# Altium project MB1605.PrjPcb (part 2 of 7)

## Sheet MP257_14x14.SchDoc: STM32MP257  I/Os
size A3; Date: Not used; ApprovedBy: Not used; CheckedBy: Not used; Author: Not used; CompanyName: STMicroelectronics; DrawnBy: Not used; Engineer: Not used; Organization: Not used; Address1: Not used; Address2: Not used; Address3: Not used; Address4: Not used; DocumentNumber: Not used; Revision: Not used; SheetNumber: 3; SheetTotal: 18; CurrentTime: Not used; CurrentDate: Not used; Time: Not used; DocumentFullPathAndName: Not used; DocumentName: Not used; ModifiedDate: Not used; ImagePath: Not used; ProjectName: Not used; Application_BuildNumber: Not used
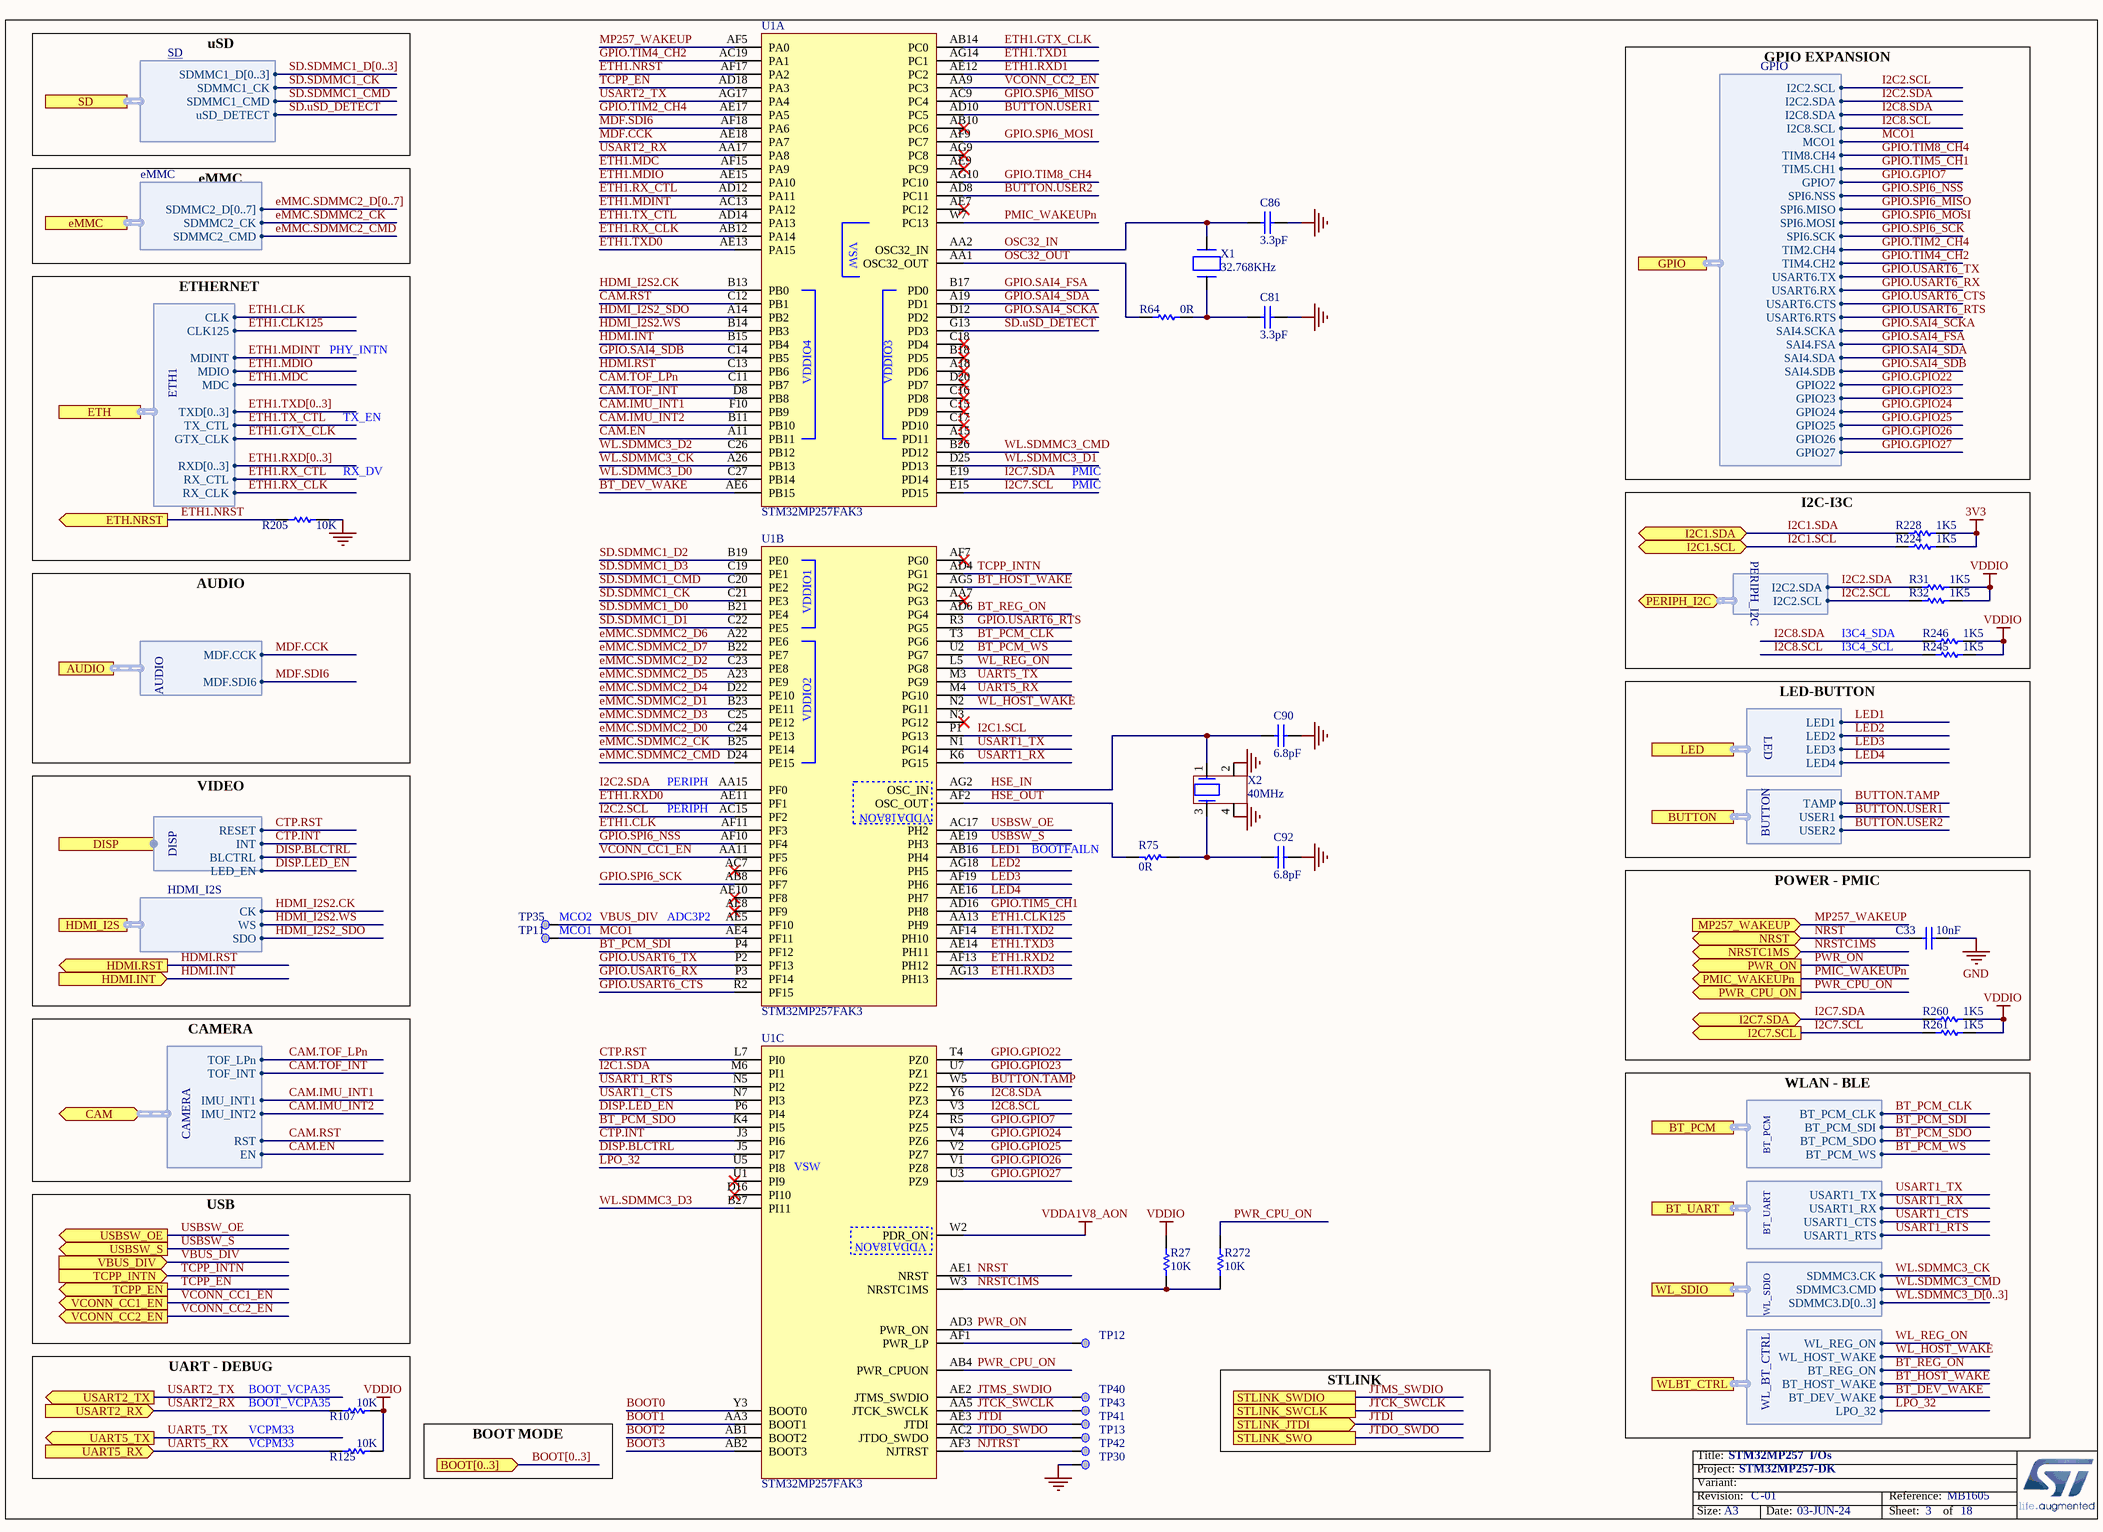
[diagram p4: MP257_14x14.SchDoc]

### Parts
C33  value 10nF  [C0402]  (hidden comment: Capacitor)
C81  value 3.3pF  [C0402]  (hidden comment: Capacitor)
C86  value 3.3pF  [C0402]  (hidden comment: Capacitor)
C90  value 6.8pF  [C0402]  (hidden comment: Capacitor)
C92  value 6.8pF  [C0402]  (hidden comment: Capacitor)
R27  value 10K  [R0402]  (hidden comment: Resistor)
R31  value 1K5  [R0402]  (hidden comment: Resistor)
R32  value 1K5  [R0402]  (hidden comment: Resistor)
R64  value 0R  [R0402]
R75  value 0R  [R0402]
R107  value 10K  [R0402]  (hidden comment: Resistor)
R125  value 10K  [R0402]  (hidden comment: Resistor)
R205  value 10K  [R0402]  (hidden comment: Resistor)
R224  value 1K5  [R0402]  (hidden comment: Resistor)
R228  value 1K5  [R0402]  (hidden comment: Resistor)
R245  value 1K5  [R0402]  (hidden comment: Resistor)
R246  value 1K5  [R0402]  (hidden comment: Resistor)
R260  value 1K5  [R0402]  (hidden comment: Resistor)
R261  value 1K5  [R0402]  (hidden comment: Resistor)
R272  value 10K  [R0402]  (hidden comment: Resistor)
TP11  Test Point  [TP_SMD_1MM]  (value not drawn)  (no BOM)
TP12  Test Point  [TP_SMD_1MM]  (value not drawn)  (no BOM)
TP13  Test Point  [TP_SMD_1MM]  (value not drawn)  (no BOM)
TP30  Test Point  [TP_SMD_1MM]  (value not drawn)  (no BOM)
TP35  Test Point  [TP_SMD_1MM]  (value not drawn)  (no BOM)
TP40  Test Point  [TP_SMD_1MM]  (value not drawn)  (no BOM)
TP41  Test Point  [TP_SMD_1MM]  (value not drawn)  (no BOM)
TP42  Test Point  [TP_SMD_1MM]  (value not drawn)  (no BOM)
TP43  Test Point  [TP_SMD_1MM]  (value not drawn)  (no BOM)
U1  STM32MP257FAK3  [ICC_TFBGA424_14X14_P050_H1P20_CODE-B0A2]  (parts A,B,C of 9)
X1  value 32.768KHz  [CRY_NX2012SA_2P]  (hidden comment: XTAL_2_PINS)
X2  value 40MHz  [CRY_NX1612SA_4P]  (hidden comment: XTAL_4_PINS)

### Ports
AUDIO (harness AUDIO), BOOT[0..3] (in), BT_PCM (harness BT_PCM), BT_UART (harness BT_UART), BUTTON (harness BUTTON), CAM (bidir, harness CAMERA), DISP (harness DISP), eMMC (harness eMMC), ETH (harness ETH1), ETH.NRST (out), GPIO (harness GPIO), HDMI.INT (in), HDMI.RST (out), HDMI_I2S (harness HDMI_I2S), I2C1.SCL (bidir), I2C1.SDA (bidir), I2C7.SCL (out), I2C7.SDA (bidir), LED (harness LED), MP257_WAKEUP (in), NRST (bidir), NRSTC1MS (bidir), PERIPH_I2C (bidir, harness PERIPH_I2C), PMIC_WAKEUPn (out), PWR_CPU_ON (out), PWR_ON (out), SD (harness SD), STLINK_JTDI (in), STLINK_SWCLK, STLINK_SWDIO, STLINK_SWO, TCPP_EN (out), TCPP_INTN (in), UART5_RX (in), UART5_TX (out), USART2_RX (in), USART2_TX (out), USBSW_OE (out), USBSW_S (out), VBUS_DIV (in), VCONN_CC1_EN (out), VCONN_CC2_EN (out), WL_SDIO (harness WL_SDIO), WLBT_CTRL (harness WL_BT_CTRL)

### Harnesses
ETH1: MDINT, CLK125, TXD[0..3], MDIO, MDC, RX_CLK, GTX_CLK, TX_CTL, RXD[0..3], RX_CTL, CLK
HDMI_I2S: CK, SDO, WS
GPIO: I2C2.SCL, I2C2.SDA, I2C8.SDA, MCO1, TIM8.CH4, TIM5.CH1, GPIO7, SPI6.NSS, SPI6.MISO, SPI6.MOSI, SPI6.SCK, TIM2.CH4, TIM4.CH2, USART6.TX, USART6.RX, USART6.CTS, USART6.RTS, I2C8.SCL, SAI4.SCKA, SAI4.FSA, SAI4.SDA, SAI4.SDB, GPIO22, GPIO23, GPIO24, GPIO25, GPIO26, GPIO27
PERIPH_I2C: I2C2.SDA, I2C2.SCL
LED: LED1, LED2, LED3, LED4
BUTTON: TAMP, USER1, USER2
CAMERA: TOF_LPn, TOF_INT, IMU_INT1, IMU_INT2, RST, EN
DISP: RESET, INT, BLCTRL, LED_EN
SD: SDMMC1_D[0..3], SDMMC1_CK, SDMMC1_CMD, uSD_DETECT
BT_PCM: BT_PCM_CLK, BT_PCM_SDI, BT_PCM_SDO, BT_PCM_WS
BT_UART: USART1_TX, USART1_RX, USART1_CTS, USART1_RTS
WL_SDIO: SDMMC3.CMD, SDMMC3.CK, SDMMC3.D[0..3]
WL_BT_CTRL: WL_REG_ON, WL_HOST_WAKE, BT_REG_ON, BT_HOST_WAKE, BT_DEV_WAKE, LPO_32
eMMC: SDMMC2_CK, SDMMC2_CMD, SDMMC2_D[0..7]
AUDIO: MDF.CCK, MDF.SDI6

### Nets
3V3: R224.2 R228.2
GND: C33.1 C81.2 C86.2 C90.1 C92.2 R205.2 TP30.1 X2.2 X2.4
VDDA1V8_AON: U1.W2(PDR_ON)
VDDIO: R27.2 R31.2 R32.2 R107.2 R125.2 R245.2 R246.2 R260.2 R261.2
BOOT0: U1.Y3(BOOT0)
BOOT1: U1.AA3(BOOT1)
BOOT2: U1.AB1(BOOT2)
BOOT3: U1.AB2(BOOT3)
BT_DEV_WAKE: U1.AE6(PB15) ; port WLBT_CTRL.BT_DEV_WAKE
BT_HOST_WAKE: U1.AG5(PG2) ; port WLBT_CTRL.BT_HOST_WAKE
BT_PCM_CLK: U1.T3(PG6) ; port BT_PCM.BT_PCM_CLK
BT_PCM_SDI: U1.P4(PF12) ; port BT_PCM.BT_PCM_SDI
BT_PCM_SDO: U1.K4(PI5) ; port BT_PCM.BT_PCM_SDO
BT_PCM_WS: U1.U2(PG7) ; port BT_PCM.BT_PCM_WS
BT_REG_ON: U1.AD6(PG4) ; port WLBT_CTRL.BT_REG_ON
BUTTON.TAMP: U1.W5(PZ2) ; port BUTTON.TAMP
BUTTON.USER1: U1.AD10(PC5) ; port BUTTON.USER1
BUTTON.USER2: U1.AD8(PC11) ; port BUTTON.USER2
CAM.EN: U1.A11(PB11) ; port CAM.EN
CAM.IMU_INT1: U1.F10(PB9) ; port CAM.IMU_INT1
CAM.IMU_INT2: U1.B11(PB10) ; port CAM.IMU_INT2
CAM.RST: U1.C12(PB1) ; port CAM.RST
CAM.TOF_INT: U1.D8(PB8) ; port CAM.TOF_INT
CAM.TOF_LPn: U1.C11(PB7) ; port CAM.TOF_LPn
CTP.INT: U1.J3(PI6) ; port DISP.INT
CTP.RST: U1.L7(PI0) ; port DISP.RESET
DISP.BLCTRL: U1.J5(PI7) ; port DISP.BLCTRL
DISP.LED_EN: U1.P6(PI4) ; port DISP.LED_EN
eMMC.SDMMC2_CK: U1.B25(PE14) ; port eMMC.SDMMC2_CK
eMMC.SDMMC2_CMD: U1.D24(PE15) ; port eMMC.SDMMC2_CMD
eMMC.SDMMC2_D0: U1.C24(PE13)
eMMC.SDMMC2_D1: U1.B23(PE11)
eMMC.SDMMC2_D2: U1.C23(PE8)
eMMC.SDMMC2_D3: U1.C25(PE12)
eMMC.SDMMC2_D4: U1.D22(PE10)
eMMC.SDMMC2_D5: U1.A23(PE9)
eMMC.SDMMC2_D6: U1.A22(PE6)
eMMC.SDMMC2_D7: U1.B22(PE7)
ETH1.CLK: U1.AF11(PF3) ; port ETH.CLK
ETH1.CLK125: U1.AA13(PH9) ; port ETH.CLK125
ETH1.GTX_CLK: U1.AB14(PC0) ; port ETH.GTX_CLK
ETH1.MDC: U1.AF15(PA9) ; port ETH.MDC
ETH1.MDINT: U1.AC13(PA12) ; port ETH.MDINT
ETH1.MDIO: U1.AE15(PA10) ; port ETH.MDIO
ETH1.NRST: R205.1 U1.AF17(PA2) ; port ETH.NRST
ETH1.RX_CLK: U1.AB12(PA14) ; port ETH.RX_CLK
ETH1.RX_CTL: U1.AD12(PA11) ; port ETH.RX_CTL
ETH1.RXD0: U1.AE11(PF1)
ETH1.RXD1: U1.AE12(PC2)
ETH1.RXD2: U1.AF13(PH12)
ETH1.RXD3: U1.AG13(PH13)
ETH1.TX_CTL: U1.AD14(PA13) ; port ETH.TX_CTL
ETH1.TXD0: U1.AE13(PA15)
ETH1.TXD1: U1.AG14(PC1)
ETH1.TXD2: U1.AF14(PH10)
ETH1.TXD3: U1.AE14(PH11)
GPIO.GPIO7: U1.R5(PZ5) ; port GPIO.GPIO7  [project net EXP_GPIO7]
GPIO.GPIO22: U1.T4(PZ0) ; port GPIO.GPIO22  [project net EXP_GPIO22]
GPIO.GPIO23: U1.U7(PZ1) ; port GPIO.GPIO23  [project net EXP_GPIO23]
GPIO.GPIO24: U1.V4(PZ6) ; port GPIO.GPIO24  [project net EXP_GPIO24]
GPIO.GPIO25: U1.V2(PZ7) ; port GPIO.GPIO25  [project net EXP_GPIO25]
GPIO.GPIO26: U1.V1(PZ8) ; port GPIO.GPIO26  [project net EXP_GPIO26]
GPIO.GPIO27: U1.U3(PZ9) ; port GPIO.GPIO27  [project net EXP_GPIO27]
GPIO.SAI4_FSA: U1.B17(PD0) ; port GPIO.SAI4.FSA  [project net EXP_GPIO19]
GPIO.SAI4_SCKA: U1.D12(PD2) ; port GPIO.SAI4.SCKA  [project net EXP_GPIO18]
GPIO.SAI4_SDA: U1.A19(PD1) ; port GPIO.SAI4.SDA  [project net EXP_GPIO20]
GPIO.SAI4_SDB: U1.C14(PB5) ; port GPIO.SAI4.SDB  [project net EXP_GPIO21]
GPIO.SPI6_MISO: U1.AC9(PC4) ; port GPIO.SPI6.MISO  [project net EXP_GPIO9]
GPIO.SPI6_MOSI: U1.AF9(PC7) ; port GPIO.SPI6.MOSI  [project net EXP_GPIO10]
GPIO.SPI6_NSS: U1.AF10(PF4) ; port GPIO.SPI6.NSS  [project net EXP_GPIO8]
GPIO.SPI6_SCK: U1.AB8(PF7) ; port GPIO.SPI6.SCK  [project net EXP_GPIO11]
GPIO.TIM2_CH4: U1.AE17(PA5) ; port GPIO.TIM2.CH4  [project net EXP_GPIO12]
GPIO.TIM4_CH2: U1.AC19(PA1) ; port GPIO.TIM4.CH2  [project net EXP_GPIO13]
GPIO.TIM5_CH1: U1.AD16(PH8) ; port GPIO.TIM5.CH1  [project net EXP_GPIO6]
GPIO.TIM8_CH4: U1.AG10(PC10) ; port GPIO.TIM8.CH4  [project net EXP_GPIO5]
GPIO.USART6_CTS: U1.R2(PF15) ; port GPIO.USART6.CTS  [project net EXP_GPIO16]
GPIO.USART6_RTS: U1.R3(PG5) ; port GPIO.USART6.RTS  [project net EXP_GPIO17]
GPIO.USART6_RX: U1.P3(PF14) ; port GPIO.USART6.RX  [project net EXP_GPIO15]
GPIO.USART6_TX: U1.P2(PF13) ; port GPIO.USART6.TX  [project net EXP_GPIO14]
HDMI.INT: U1.B15(PB4) ; port HDMI.INT
HDMI.RST: U1.C13(PB6) ; port HDMI.RST
HDMI_I2S2.CK: U1.B13(PB0) ; port HDMI_I2S.CK
HDMI_I2S2.WS: U1.B14(PB3) ; port HDMI_I2S.WS
HDMI_I2S2_SDO: U1.A14(PB2) ; port HDMI_I2S.SDO
HSE_IN: C90.2 U1.AG2(OSC_IN) X2.1
HSE_OUT: R75.2 U1.AF2(OSC_OUT)
I2C1.SCL: R224.1 U1.P1(PG13) ; port I2C1.SCL
I2C1.SDA: R228.1 U1.M6(PI1) ; port I2C1.SDA
I2C2.SCL: R32.1 U1.AC15(PF2) ; port GPIO.I2C2.SCL, port PERIPH_I2C.I2C2.SCL
I2C2.SDA: R31.1 U1.AA15(PF0) ; port GPIO.I2C2.SDA, port PERIPH_I2C.I2C2.SDA
I2C7.SCL: R261.1 U1.E15(PD15) ; port I2C7.SCL
I2C7.SDA: R260.1 U1.E19(PD14) ; port I2C7.SDA
I2C8.SCL: R245.1 U1.V3(PZ4) ; port GPIO.I2C8.SCL  [project net EXP_GPIO3]
I2C8.SDA: R246.1 U1.Y6(PZ3) ; port GPIO.I2C8.SDA  [project net EXP_GPIO2]
JTCK_SWCLK: TP43.1 U1.AA5(JTCK_SWCLK) ; port STLINK_SWCLK
JTDI: TP41.1 U1.AE3(JTDI) ; port STLINK_JTDI
JTDO_SWDO: TP13.1 U1.AC2(JTDO_SWDO) ; port STLINK_SWO
JTMS_SWDIO: TP40.1 U1.AE2(JTMS_SWDIO) ; port STLINK_SWDIO
LED1: U1.AB16(PH4) ; port LED.LED1
LED2: U1.AG18(PH5) ; port LED.LED2
LED3: U1.AF19(PH6) ; port LED.LED3
LED4: U1.AE16(PH7) ; port LED.LED4
LPO_32: U1.U5(PI8) ; port WLBT_CTRL.LPO_32
MCO1: TP11.1 U1.AE4(PF11) ; port GPIO.MCO1  [project net EXP_GPIO4]
MDF.CCK: U1.AE18(PA7) ; port AUDIO.MDF.CCK
MDF.SDI6: U1.AF18(PA6) ; port AUDIO.MDF.SDI6
MP257_WAKEUP: U1.AF5(PA0) ; port MP257_WAKEUP
NJTRST: TP42.1 U1.AF3(NJTRST)
NRST: C33.2 U1.AE1(NRST) ; port NRST
NRSTC1MS: R27.1 R272.1 U1.W3(NRSTC1MS) ; port NRSTC1MS
OSC32_IN: C86.1 U1.AA2(OSC32_IN) X1.2(X2)
OSC32_OUT: R64.1 U1.AA1(OSC32_OUT)
PMIC_WAKEUPn: U1.W7(PC13) ; port PMIC_WAKEUPn
PWR_CPU_ON: R272.2 U1.AB4(PWR_CPUON) ; port PWR_CPU_ON
PWR_ON: U1.AD3(PWR_ON) ; port PWR_ON
SD.SDMMC1_CK: U1.C21(PE3) ; port SD.SDMMC1_CK
SD.SDMMC1_CMD: U1.C20(PE2) ; port SD.SDMMC1_CMD
SD.SDMMC1_D0: U1.B21(PE4)
SD.SDMMC1_D1: U1.C22(PE5)
SD.SDMMC1_D2: U1.B19(PE0)
SD.SDMMC1_D3: U1.C19(PE1)
SD.uSD_DETECT: U1.G13(PD3) ; port SD.uSD_DETECT
TCPP_EN: U1.AD18(PA3) ; port TCPP_EN
TCPP_INTN: U1.AD4(PG1) ; port TCPP_INTN
UART5_RX: R125.1 U1.M4(PG10) ; port UART5_RX
UART5_TX: U1.M3(PG9) ; port UART5_TX
USART1_CTS: U1.N7(PI3) ; port BT_UART.USART1_CTS
USART1_RTS: U1.N5(PI2) ; port BT_UART.USART1_RTS
USART1_RX: U1.K6(PG15) ; port BT_UART.USART1_RX
USART1_TX: U1.N1(PG14) ; port BT_UART.USART1_TX
USART2_RX: R107.1 U1.AA17(PA8) ; port USART2_RX
USART2_TX: U1.AG17(PA4) ; port USART2_TX
USBSW_OE: U1.AC17(PH2) ; port USBSW_OE
USBSW_S: U1.AE19(PH3) ; port USBSW_S
VBUS_DIV: TP35.1 U1.AE5(PF10) ; port VBUS_DIV
VCONN_CC1_EN: U1.AA11(PF5) ; port VCONN_CC1_EN
VCONN_CC2_EN: U1.AA9(PC3) ; port VCONN_CC2_EN
WL.SDMMC3_CK: U1.A26(PB13) ; port WL_SDIO.SDMMC3.CK
WL.SDMMC3_CMD: U1.B26(PD12) ; port WL_SDIO.SDMMC3.CMD
WL.SDMMC3_D0: U1.C27(PB14)
WL.SDMMC3_D1: U1.D25(PD13)
WL.SDMMC3_D2: U1.C26(PB12)
WL.SDMMC3_D3: U1.B27(PI11)
WL_HOST_WAKE: U1.N2(PG11) ; port WLBT_CTRL.WL_HOST_WAKE
WL_REG_ON: U1.L5(PG8) ; port WLBT_CTRL.WL_REG_ON
NetC81_1: C81.1 R64.2 X1.1(X1)
NetC92_1: C92.1 R75.1 X2.3
NetTP12_1: TP12.1 U1.AF1(PWR_LP)

Not connected (* = marked no-connect by the designer): U1 A15(PD11)* A18(PD6)* AA7(PG3)* AB10(PC6)* AC7(PF6)* AE7(PC12)* AE8(PF9)* AE9(PC9)* AE10(PF8)* AF7(PG0)* AG9(PC8)* B18(PD5)* C15(PD9)* C16(PD8)* C17(PD10)* C18(PD4)* D16(PI10)* D20(PD7)* N3(PG12)* U1(PI9)*

### Buses and harness runs
bus BOOT[0..3] = port BOOT[0..3]
bus eMMC.SDMMC2_D[0..7]
bus ETH1.RXD[0..3]
bus ETH1.TXD[0..3]
bus SD.SDMMC1_D[0..3]
bus WL.SDMMC3_D[0..3]

### Notes on the sheet
- uSD
- eMMC
- PHY_INTN
- TX_EN
- (near R205) RX_DV
- PMIC
- GPIO EXPANSION
- (near R205) ETHERNET
- I2C-I3C
- I3C4_SDA
- I3C4_SCL
- AUDIO
- PERIPH
- (near R75) BOOTFAILN
- LED-BUTTON
- MCO2
- MCO1
- ADC3P2
- VIDEO
- POWER - PMIC
- CAMERA
- USB
- (near R107) BOOT_VCPA35
- UART - DEBUG
- VCPM33
- BOOT MODE
- STLINK
- WLAN - BLE
- Title:
- Project:
- Size:
- Revision:
- Variant:
- A3
- -
- Date:
- Reference:
- Sheet:
- of
- (in symbol MCD-03375, part A) VSW
- (in symbol MCD-03375, part C) VSW

### Library data of the parts
C33 = MCD-00011: Capacitor, MLCC, 10nF, 16V, X7R, 10%, 0402, T=0.5mm; Manufacturer_Part_Number: CC0402KRX7R7BB103; Manufacturer: YAGEO; Provided_By: SUBCO; Initial_Board_Reference: MB1274; Internal_Part_Number: MCD-00011; Status: Released; Part_Type: Capacitor; Package: C0402; ComponentLink1Description: Datasheet; ComponentLink1URL: http://tunmcdsvn.tun.st.com/Component_Datasheet_Library/Trunk/Capacitors/Yageo_Multilayer_Capacitor_X7R_series_100pF_to_22uF; ECCN_US: n/a; ECCN_EU: n/a
C81 C86 = MCD-01775: Capacitor, MLCC, 3.3pF, 50V, NPO, +/-0.1pF, 0402, T=0.5mm; Part_Preference: Recommended; Manufacturer: YAGEO; Manufacturer_Part_Number: CC0402BRNPO9BN3R3; Component_Country_Of_Origin: China; ShowFields: YES; ID: 3875; Internal_Part_Number: MCD-01775; Status: Released; Part_Type: Capacitor; Package: 0402; ComponentLink1URL: http://tunmcdsvn.tun.st.com/Component_Documentation_Library/Trunk/Capacitor/YAGEO_NP0_Series; Order_Code_Digikey: 311-1621-1-ND; Order_Code_Farnell: N/A; Order_Code_RS: N/A
C90 C92 = MCD-00674: Capacitor, MLCC, 6.8pF, 50V, NPO, +-0.25pF, 0402, T=0.5mm; Manufacturer_Part_Number: CC0402CRNPO9BN6R8; Manufacturer: YAGEO; Part_Preference: Recommended; Provided_By: SUBCO; Initial_Board_Reference: MB1319; Component_Country_Of_Origin: China; ID: 3068; ShowFields: YES; Internal_Part_Number: MCD-00674; Status: Released; Part_Type: Capacitor; Package: 0402; ComponentLink1Description: Datasheet; ComponentLink1URL: http://tunmcdsvn.tun.st.com/Component_Documentation_Library/Trunk/Capacitor/YAGEO_NP0_Series; ECCN_US: n/a; ECCN_EU: n/a; Alternate_Manufacturer: N/A; Alternate_Manufacturer_Part_Number: N/A; Order_Code_Digikey: 311-3327-1-ND; Order_Code_Farnell: N/A; Order_Code_RS: N/A
R27 R107 R125 R272 = MCD-00053: Resistor,10K,0402,1%,1/16W; BMS_Part_Number: 9131590; Part_Preference: Recommended; Manufacturer: YAGEO; Manufacturer_Part_Number: RC0402FR-0710KL; Component_Country_Of_Origin: China; ID: 2539; ShowFields: YES; Internal_Part_Number: MCD-00053; Status: Released; Part_Type: Resistor; Package: 0402; ComponentLink1Description: Datasheet; ComponentLink1URL: http://tunmcdsvn.tun.st.com/Component_Documentation_Library/Trunk/Resistor/YAGEO_RC_L_Series; Order_Code_Digikey: 311-10.0KLRCT-ND; Order_Code_Farnell: 9239359; Order_Code_RS: N/A; Alternate_Manufacturer: N/A; Alternate_Manufacturer_Part_Number: N/A
R31 R32 R224 R228 R245 R246 R260 R261 = MCD-00068: Resistor,1K5,0402,1%,1/16W; Part_Preference: Recommended; Manufacturer: YAGEO; Manufacturer_Part_Number: RC0402FR-071K5L; Component_Country_Of_Origin: China; ID: 2524; ShowFields: YES; Internal_Part_Number: MCD-00068; Status: Released; Part_Type: Resistor; Package: 0402; ComponentLink1Description: Datasheet; ComponentLink1URL: http://tunmcdsvn.tun.st.com/Component_Documentation_Library/Trunk/Resistor/YAGEO_RC_L_Series; Order_Code_Digikey: 311-1.50KLRCT-ND; Order_Code_Farnell: 9239251; Order_Code_RS: N/A
  R31 R32 R224 R228 R245 R246: Alternate_Manufacturer: N/A; Alternate_Manufacturer_Part_Number: N/A
R64 R75 = MCD-00052: Resistor,0R,0402,5%,1/16W; Manufacturer_Part_Number: RC0402JR-070RL; Manufacturer: YAGEO; Part_Preference: Recommended; Provided_By: SUBCO; Initial_Board_Reference: mb1274; Order_Code_RS: 618-5804; Component_Country_Of_Origin: China; ID: 2540; ShowFields: YES; Internal_Part_Number: MCD-00052; ComponentLink1Description: Datasheet; ECCN_US: n/a; ECCN_EU: n/a; Status: Released; Part_Type: Resistor; ComponentLink1URL: http://tunmcdsvn.tun.st.com/Component_Documentation_Library/Trunk/Resistor/YAGEO_RC_L_Series; Package: 0402; Alternate_Manufacturer: N/A; Alternate_Manufacturer_Part_Number: N/A; Order_Code_Digikey: 311-0.0JRCT-ND; Order_Code_Farnell: 9232516RL
R205 = MCD-00053: Resistor,10K,0402,1%,1/16W; Manufacturer_Part_Number: RC0402FR-0710KL; Manufacturer: YAGEO; BMS_Part_Number: 9131590; Part_Preference: Recommended; Component_Country_Of_Origin: China; ID: 2539; ShowFields: YES; Internal_Part_Number: MCD-00053; ComponentLink1Description: Datasheet; Status: Released; Part_Type: Resistor; ComponentLink1URL: http://tunmcdsvn.tun.st.com/Component_Documentation_Library/Trunk/Resistor/YAGEO_RC_L_Series; Package: 0402; Order_Code_Digikey: 311-10.0KLRCT-ND; Order_Code_Farnell: 9239359; Order_Code_RS: N/A; Alternate_Manufacturer: N/A; Alternate_Manufacturer_Part_Number: N/A
TP11-TP13 TP30 TP35 TP40-TP43 = MCD-00074: Test Point 1mm; Part_Type: Misc; Part_Preference: Recommended; Initial_Board_Reference: MB1274; ID: 2518; ShowFields: YES; Internal_Part_Number: MCD-00074; Status: Released; Manufacturer_Part_Number: n/a; Manufacturer: n/a; ComponentLink1Description: Datasheet; ComponentLink1URL: http://na; ECCN_US: n/a; ECCN_EU: n/a; Provided_By: n/a; Order_Code_Digikey: N/A; Order_Code_Farnell: N/A; Order_Code_RS: N/A
U1 = MCD-03375: MPU , 2xCortex-A35@1.5GHz, Cortex-M33@400MHz, TFBGA 14x14, pitch 0.5, 648KB SRAM, With Crypto; Part_Type: IC; Part_Preference: Recommended; Manufacturer: STMICROELECTRONICS; Component_Country_Of_Origin: Unknown; ShowFields: YES; ID: 5491; Value: STM32MP257FAK3; Internal_Part_Number: MCD-03375; Status: Checked; Manufacturer_Part_Number: STM32MP257FAK3; Package: TFBGA; ComponentLink1URL: http://tunmcdsvn.tun.st.com/Component_Documentation_Library/Trunk/IC/STMICROELECTRONICS_STM32MP257FAK3; Order_Code_Digikey: N/A; Order_Code_Farnell: N/A; Order_Code_RS: N/A
X1 = MCD-01479: Crystal, 32.768kHz, 6pF, +/-20ppm, 80K, 2.05x1.2mm; BMS_Part_Number: 9157049; Part_Type: Crystal_Osc; Part_Preference: Recommended; Manufacturer: NDK; Manufacturer_Part_Number: NX2012SA-32.768KHZ-EXS00A-MU00527; Component_Country_Of_Origin: Unknown; ShowFields: YES; ID: 3579; Internal_Part_Number: MCD-01479; Status: Released; Package: 2.05x1.2mm; ComponentLink1URL: http://tunmcdsvn.tun.st.com/Component_Documentation_Library/Trunk/Crytal_Oscillator/NDK_NX2012SA_Series; Order_Code_Digikey: 644-1352; Order_Code_Farnell: N/A; Order_Code_RS: N/A
X2 = MCD-02344: Crystal, 40MHz, 6pF, +/-20ppm, 80R, 1.6x1.2mm; Part_Type: Crystal_Osc; Part_Preference: Recommended; Manufacturer: NDK; Manufacturer_Part_Number: NX1612SA-40MHZ-EXS00A-CS13836; Component_Country_Of_Origin: Unknown; ShowFields: YES; ID: 4450; Internal_Part_Number: MCD-02344; Status: Checked; Package: 1.6x1.2mm; ComponentLink1URL: http://tunmcdsvn.tun.st.com/Component_Documentation_Library/Trunk/Crytal_Oscillator/NDK_NX1612SA_Series/; Order_Code_Digikey: N/A; Order_Code_Farnell: N/A; Order_Code_RS: N/A

## Sheet Power_PMIC.SchDoc: Power PMIC
size A3; Date: Not used; ApprovedBy: Not used; CheckedBy: Not used; Author: Not used; CompanyName: STMicroelectronics; DrawnBy: Not used; Engineer: Not used; Organization: Not used; Address1: Not used; Address2: Not used; Address3: Not used; Address4: Not used; DocumentNumber: Not used; Revision: Not used; SheetNumber: 4; SheetTotal: 18; CurrentTime: Not used; CurrentDate: Not used; Time: Not used; DocumentFullPathAndName: Not used; DocumentName: Not used; ModifiedDate: Not used; ImagePath: Not used; ProjectName: Not used; Application_BuildNumber: Not used
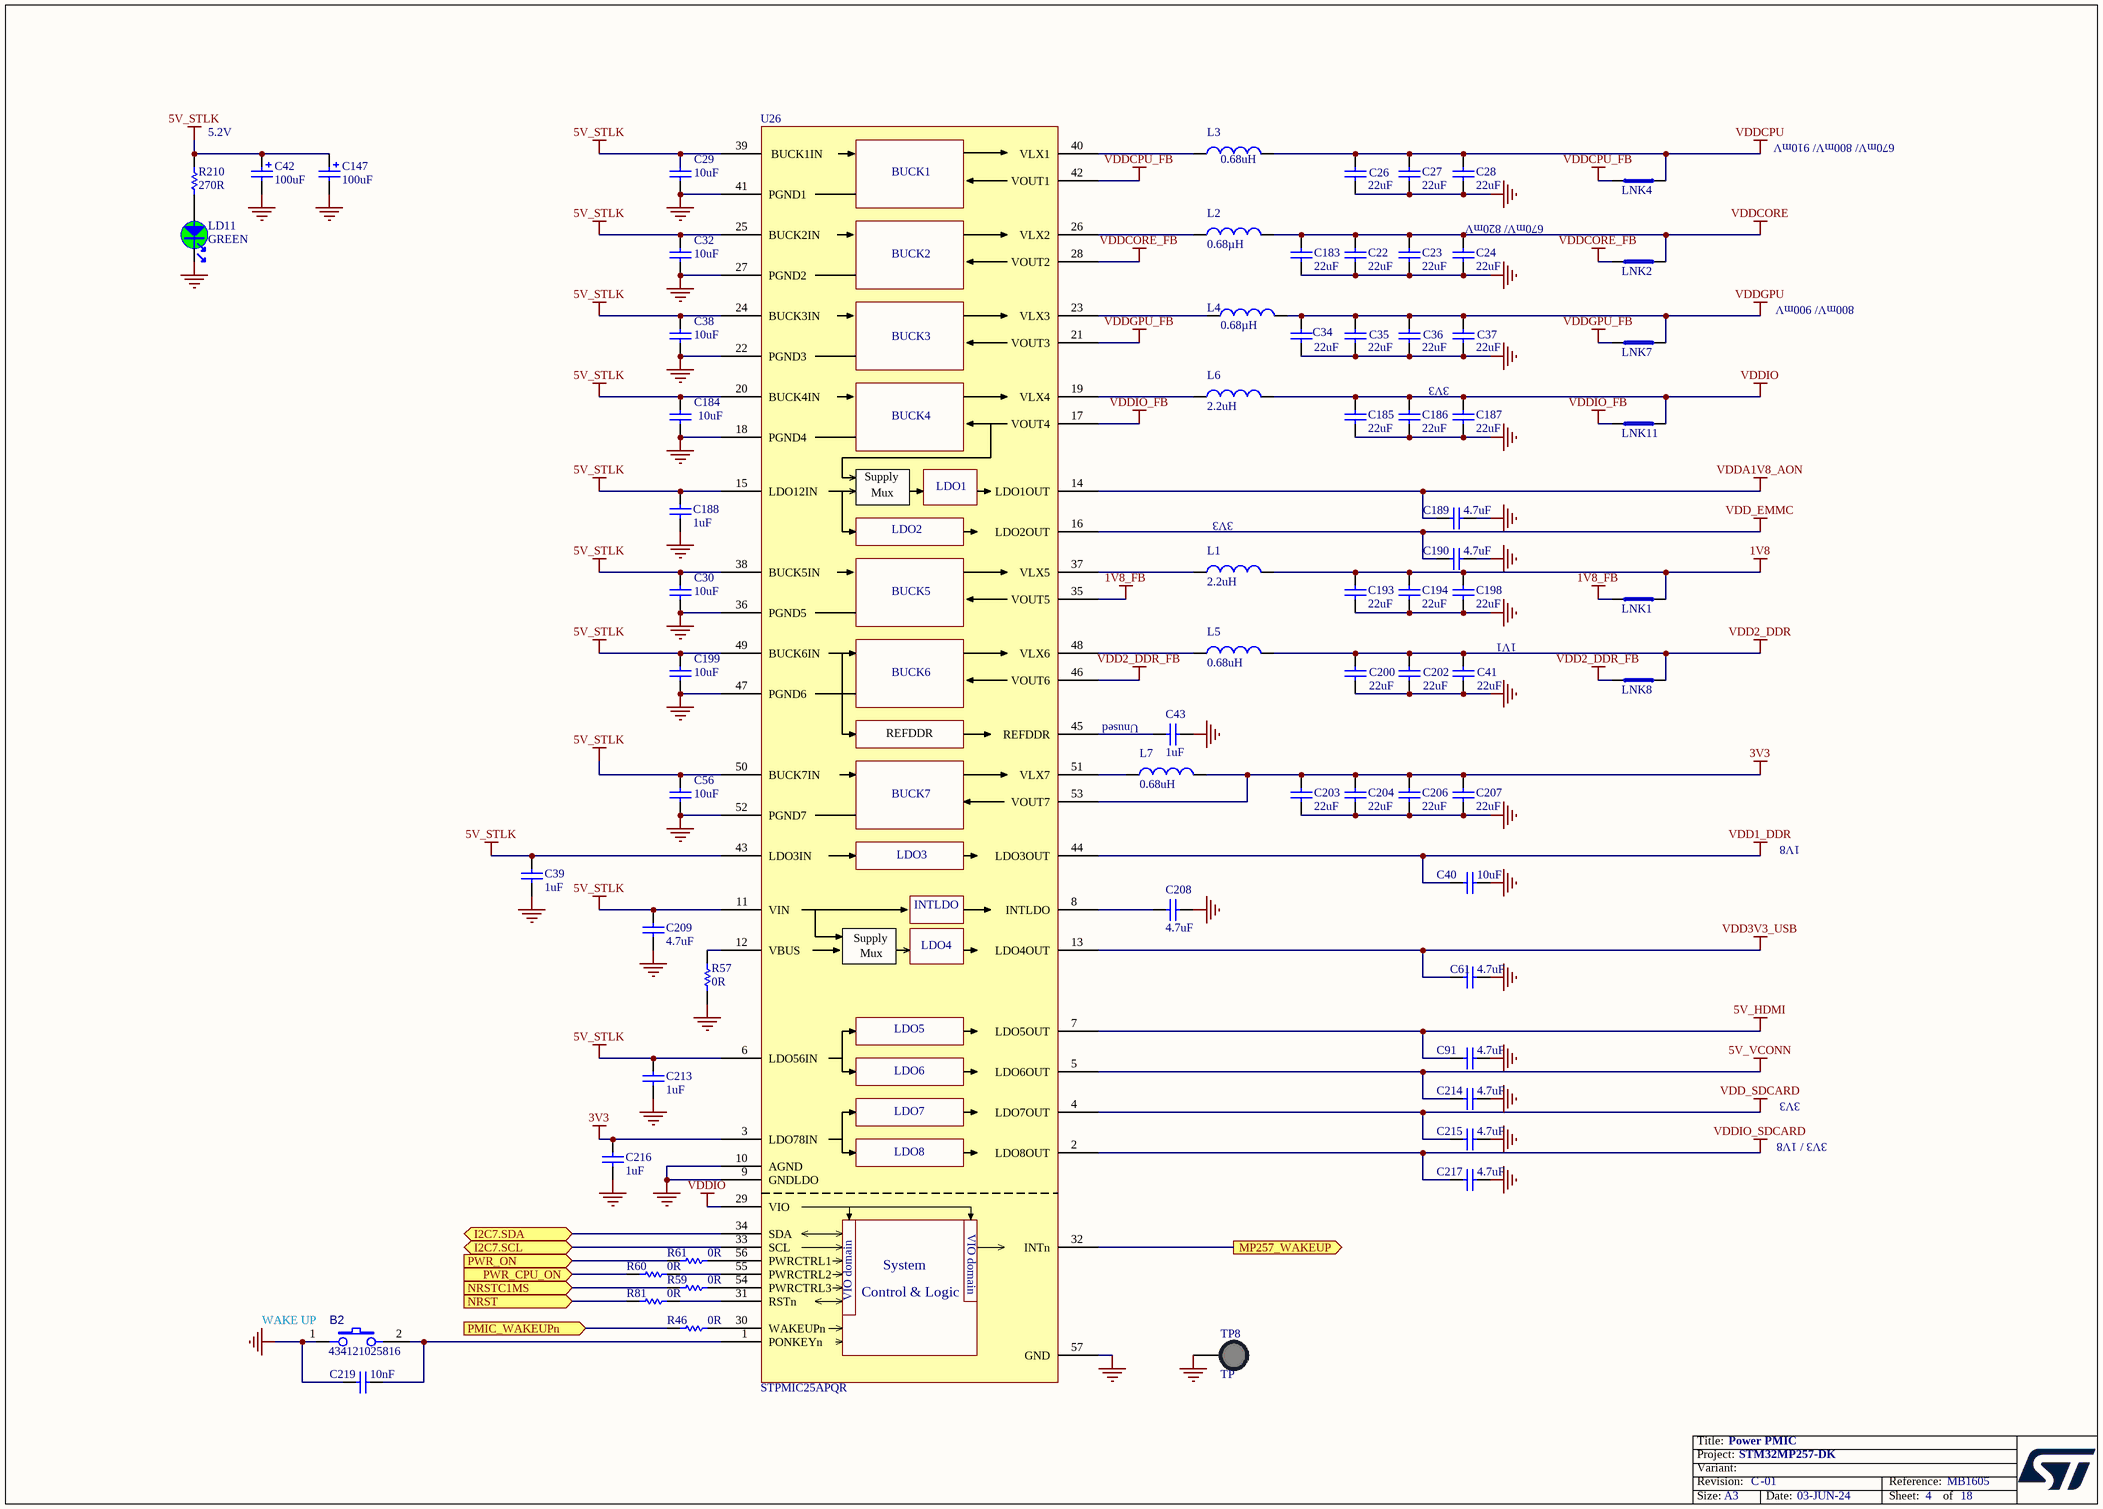
[diagram p5: Power_PMIC.SchDoc]

### Parts
B2  value 434121025816  [SWI_WE_434121025816]  (hidden comment: SW_PUSH_SMD_2P)
C22  value 22uF  [C0603]  (hidden comment: Capacitor)
C23  value 22uF  [C0603]  (hidden comment: Capacitor)
C24  value 22uF  [C0603]  (hidden comment: Capacitor)
C26  value 22uF  [C0603]  (hidden comment: Capacitor)
C27  value 22uF  [C0603]  (hidden comment: Capacitor)
C28  value 22uF  [C0603]  (hidden comment: Capacitor)
C29  value 10uF  [C0603]  (hidden comment: Capacitor)
C30  value 10uF  [C0603]  (hidden comment: Capacitor)
C32  value 10uF  [C0603]  (hidden comment: Capacitor)
C34  value 22uF  [C0603]  (hidden comment: Capacitor)
C35  value 22uF  [C0603]  (hidden comment: Capacitor)
C36  value 22uF  [C0603]  (hidden comment: Capacitor)
C37  value 22uF  [C0603]  (hidden comment: Capacitor)
C38  value 10uF  [C0603]  (hidden comment: Capacitor)
C39  value 1uF  [C0402]  (hidden comment: Capacitor)
C40  value 10uF  [C0402]  (hidden comment: Capacitor)
C41  value 22uF  [C0603]  (hidden comment: Capacitor)
C42  value 100uF  [CPOL_TCJ-B_1210_H210]  (hidden comment: Cap_POL_TANA)
C43  value 1uF  [C0402]  (hidden comment: Capacitor)
C56  value 10uF  [C0603]  (hidden comment: Capacitor)
C61  value 4.7uF  [C0402]  (hidden comment: Capacitor)
C91  value 4.7uF  [C0402]  (hidden comment: Capacitor)
C147  value 100uF  [CPOL_TCJ-B_1210_H210]  (hidden comment: Cap_POL_TANA)
C183  value 22uF  [C0603]  (hidden comment: Capacitor)
C184  value 10uF  [C0603]  (hidden comment: Capacitor)
C185  value 22uF  [C0805]  (hidden comment: Capacitor)
C186  value 22uF  [C0805]  (hidden comment: Capacitor)
C187  value 22uF  [C0805]  (hidden comment: Capacitor)
C188  value 1uF  [C0402]  (hidden comment: Capacitor)
C189  value 4.7uF  [C0402]  (hidden comment: Capacitor)
C190  value 4.7uF  [C0402]  (hidden comment: Capacitor)
C193  value 22uF  [C0805]  (hidden comment: Capacitor)
C194  value 22uF  [C0805]  (hidden comment: Capacitor)
C198  value 22uF  [C0805]  (hidden comment: Capacitor)
C199  value 10uF  [C0603]  (hidden comment: Capacitor)
C200  value 22uF  [C0603]  (hidden comment: Capacitor)
C202  value 22uF  [C0603]  (hidden comment: Capacitor)
C203  value 22uF  [C0805]  (hidden comment: Capacitor)
C204  value 22uF  [C0805]  (hidden comment: Capacitor)
C206  value 22uF  [C0805]  (hidden comment: Capacitor)
C207  value 22uF  [C0805]  (hidden comment: Capacitor)
C208  value 4.7uF  [C0402]  (hidden comment: Capacitor)
C209  value 4.7uF  [C0402]  (hidden comment: Capacitor)
C213  value 1uF  [C0402]  (hidden comment: Capacitor)
C214  value 4.7uF  [C0402]  (hidden comment: Capacitor)
C215  value 4.7uF  [C0402]  (hidden comment: Capacitor)
C216  value 1uF  [C0402]  (hidden comment: Capacitor)
C217  value 4.7uF  [C0402]  (hidden comment: Capacitor)
C219  value 10nF  [C0402]  (hidden comment: Capacitor)
L1  value 2.2uH  [IND_2016_MURATA_LQM2MPN2R2NG0]  (hidden comment: Inductor)
L2  value 0.68µH  [IND_2520_TOKO_DFE252012P]  (hidden comment: Inductor)
L3  value 0.68uH  [IND_2016_MURATA_LQM2MPN2R2NG0]  (hidden comment: Inductor)
L4  value 0.68µH  [IND_2520_TOKO_DFE252012P]  (hidden comment: Inductor)
L5  value 0.68uH  [IND_2016_MURATA_LQM2MPN2R2NG0]  (hidden comment: Inductor)
L6  value 2.2uH  [IND_2016_MURATA_LQM2MPN2R2NG0]  (hidden comment: Inductor)
L7  value 0.68uH  [IND_2016_MURATA_LQM2MPN2R2NG0]  (hidden comment: Inductor)
LD11  value GREEN  [LED_0603_OSRAM_LG-Q396-PS-35_GREEN_1A2K_H0P4]  (hidden comment: LED_green)
LNK1  link_200  [LINK200]  (value not drawn)  (no BOM)
LNK2  link_200  [LINK200]  (value not drawn)  (no BOM)
LNK4  link_200  [LINK200]  (value not drawn)  (no BOM)
LNK7  link_200  [LINK200]  (value not drawn)  (no BOM)
LNK8  link_200  [LINK200]  (value not drawn)  (no BOM)
LNK11  link_200  [LINK200]  (value not drawn)  (no BOM)
R46  value 0R  [R0402]
R57  value 0R  [R0402]
R59  value 0R  [R0402]
R60  value 0R  [R0402]
R61  value 0R  [R0402]
R81  value 0R  [R0402]
R210  value 270R  [R0402]  (hidden comment: Resistor)
TP8  value TP  [TP_PTH-1P02MM_TEST-TERMINAL_RS_101-2391_BLACK]  (hidden comment: Test_pin_conn_black)
U26  STPMIC25APQR  [ICC_QFN56-EPAD_6P5X6P5_P040]

### Ports
I2C7.SCL (bidir), I2C7.SDA (bidir), MP257_WAKEUP (out), NRST (in), NRSTC1MS (in), PMIC_WAKEUPn (in), PWR_CPU_ON (in), PWR_ON (in)

### Nets
1V8: C193.2 C194.2 C198.2 L1.2 LNK1.2
1V8_FB: LNK1.1 U26.35(VOUT5)
3V3: C203.2 C204.2 C206.2 C207.2 C216.2 L7.2 U26.3(LDO78IN) U26.53(VOUT7)
5V_HDMI: C91.1 U26.7(LDO5OUT)
5V_STLK: C29.2 C30.2 C32.2 C38.2 C39.2 C42.1 C56.2 C147.1 C184.2 C188.2 C199.2 C209.2 C213.2 R210.1 U26.6(LDO56IN) U26.11(VIN) U26.15(LDO12IN) U26.20(BUCK4IN) U26.24(BUCK3IN) U26.25(BUCK2IN) U26.38(BUCK5IN) U26.39(BUCK1IN) U26.43(LDO3IN) U26.49(BUCK6IN) U26.50(BUCK7IN)
5V_VCONN: C214.1 U26.5(LDO6OUT)
GND: B2.1 C22.1 C23.1 C24.1 C26.1 C27.1 C28.1 C29.1 C30.1 C32.1 C34.1 C35.1 C36.1 C37.1 C38.1 C39.1 C40.1 C41.1 C42.2 C43.1 C56.1 C61.1 C91.2 C147.2 C183.1 C184.1 C185.1 C186.1 C187.1 C188.1 C189.1 C190.2 C193.1 C194.1 C198.1 C199.1 C200.1 C202.1 C203.1 C204.1 C206.1 C207.1 C208.2 C209.1 C213.1 C214.2 C215.2 C216.1 C217.2 C219.1 LD11.2 R57.1 TP8.1 U26.9(GNDLDO) U26.10(AGND) U26.18(PGND4) U26.22(PGND3) U26.27(PGND2) U26.36(PGND5) U26.41(PGND1) U26.47(PGND6) U26.52(PGND7) U26.57(GND)
VDD1_DDR: C40.2 U26.44(LDO3OUT)
VDD2_DDR: C41.2 C200.2 C202.2 L5.2 LNK8.2
VDD2_DDR_FB: LNK8.1 U26.46(VOUT6)
VDD3V3_USB: C61.2 U26.13(LDO4OUT)
VDD_EMMC: C190.1 U26.16(LDO2OUT)
VDD_SDCARD: C215.1 U26.4(LDO7OUT)
VDDA1V8_AON: C189.2 U26.14(LDO1OUT)
VDDCORE: C22.2 C23.2 C24.2 C183.2 L2.2 LNK2.2
VDDCORE_FB: LNK2.1 U26.28(VOUT2)
VDDCPU: C26.2 C27.2 C28.2 L3.2 LNK4.1
VDDCPU_FB: LNK4.2 U26.42(VOUT1)
VDDGPU: C34.2 C35.2 C36.2 C37.2 L4.2 LNK7.2
VDDGPU_FB: LNK7.1 U26.21(VOUT3)
VDDIO: C185.2 C186.2 C187.2 L6.2 LNK11.2 U26.29(VIO)
VDDIO_FB: LNK11.1 U26.17(VOUT4)
VDDIO_SDCARD: C217.1 U26.2(LDO8OUT)
I2C7.SCL: U26.33(SCL) ; port I2C7.SCL
I2C7.SDA: U26.34(SDA) ; port I2C7.SDA
MP257_WAKEUP: U26.32(INTn) ; port MP257_WAKEUP
NRST: R81.1 ; port NRST
NRSTC1MS: R59.1 ; port NRSTC1MS
PMIC_WAKEUPn: R46.1 ; port PMIC_WAKEUPn
PWR_CPU_ON: R60.1 ; port PWR_CPU_ON
PWR_ON: R61.1 ; port PWR_ON
NetB2_2: B2.2 C219.2 U26.1(PONKEYn)
NetC43_2: C43.2 U26.45(REFDDR)
NetC208_1: C208.1 U26.8(INTLDO)
NetL1_1: L1.1 U26.37(VLX5)
NetL2_1: L2.1 U26.26(VLX2)
NetL3_1: L3.1 U26.40(VLX1)
NetL4_1: L4.1 U26.23(VLX3)
NetL5_1: L5.1 U26.48(VLX6)
NetL6_1: L6.1 U26.19(VLX4)
NetL7_1: L7.1 U26.51(VLX7)
NetLD11_1: LD11.1 R210.2
NetR46_2: R46.2 U26.30(WAKEUPn)
NetR57_2: R57.2 U26.12(VBUS)
NetR59_2: R59.2 U26.54(PWRCTRL3)
NetR60_2: R60.2 U26.55(PWRCTRL2)
NetR61_2: R61.2 U26.56(PWRCTRL1)
NetR81_2: R81.2 U26.31(RSTn)

### Notes on the sheet
- 5.2V
- 670mV/ 800mV/ 910mV
- (near C24) 670mV/ 820mV
- 800mV/ 900mV
- 3V3
- (near L1) 3V3
- 1V1
- Unused
- 1V8
- 3V3 / 1V8
- (near B2) WAKE UP
- Title:
- Project:
- Size:
- Revision:
- Variant:
- A3
- -
- Date:
- Reference:
- Sheet:
- of
- (in symbol MCD-03000) BUCK1; BUCK2; BUCK3; BUCK4; Supply; LDO1; Mux; LDO2; BUCK5; BUCK6; BUCK7; LDO3; LDO4; LDO5; LDO6; LDO7; LDO8; VIO domain; System; Control & Logic

### Library data of the parts
B2 = MCD-03492: Switch tactile, SPST-NO, 50mA, 12V, 6x3.8mm; Part_Type: Misc; Part_Preference: Recommended; Manufacturer: WURTH ELEKTRONIC; Component_Country_Of_Origin: China°; ShowFields: YES; ID: 5608; Internal_Part_Number: MCD-03492; Status: Checked; Manufacturer_Part_Number: 434121025816; Package: 6x3.8mm; ComponentLink1URL: http://tunmcdsvn.tun.st.com/Component_Documentation_Library/Trunk/Misc/WURTH_ELECTRONIK_434121025816; Order_Code_Digikey: 732-7045-2-ND; Order_Code_Farnell: 1867991; Order_Code_RS: N/A
C22-C24 C26 C34-C37 C41 C200 C202 = MCD-00100: Capacitor, MLCC, 22uF, 6V3, X5R, +/-20%, 0603, T=0,8mm; Manufacturer_Part_Number: GRM188R60J226MEA0J; Manufacturer: MURATA; Part_Preference: Recommended; Component_Country_Of_Origin: Japan; ID: 2766; ShowFields: YES; Internal_Part_Number: MCD-00100; Status: Released; Part_Type: Capacitor; Package: 0603; ComponentLink1Description: Part_Information; ComponentLink1URL: http://tunmcdsvn.tun.st.com/Component_Documentation_Library/Trunk/Capacitor/MURATA_GRM_Series; Order_Code_Digikey: 490-7612-2-ND; Order_Code_Farnell: N/A; Order_Code_RS: N/A; Alternate_Manufacturer: N/A; Alternate_Manufacturer_Part_Number: N/A
C27 C28 C183 = MCD-00100: Capacitor, MLCC, 22uF, 6V3, X5R, +/-20%, 0603, T=0,8mm; Part_Preference: Recommended; Manufacturer: MURATA; Manufacturer_Part_Number: GRM188R60J226MEA0J; Component_Country_Of_Origin: Japan; ID: 2766; ShowFields: YES; Internal_Part_Number: MCD-00100; Status: Released; Part_Type: Capacitor; Package: 0603; ComponentLink1URL: http://tunmcdsvn.tun.st.com/Component_Documentation_Library/Trunk/Capacitor/MURATA_GRM_Series; Order_Code_Digikey: 490-7612-2-ND; Order_Code_Farnell: N/A; Order_Code_RS: N/A; ComponentLink1Description: Part_Information; Alternate_Manufacturer: N/A; Alternate_Manufacturer_Part_Number: N/A
C29 C30 C32 C38 C56 C184 C199 = MCD-00099: Capacitor, MLCC, 10uF, 10V, X5R, +/-10%, 0603, T=0,8mm; Manufacturer_Part_Number: GRM188R61A106KE69D; Manufacturer: MURATA; Part_Preference: Recommended; Order_Code_RS: 170-6168; Component_Country_Of_Origin: Japan; ID: 2770; ShowFields: YES; Internal_Part_Number: MCD-00099; Status: Released; Part_Type: Capacitor; Package: 0603; ComponentLink1Description: Part_Information; ComponentLink1URL: http://tunmcdsvn.tun.st.com/Component_Documentation_Library/Trunk/Capacitor/MURATA_GRM_Series; Order_Code_Digikey: 490-10474-1-ND; Order_Code_Farnell: 2494233; Alternate_Manufacturer: N/A; Alternate_Manufacturer_Part_Number: N/A
C39 C43 C188 C213 C216 = MCD-00095: Capacitor, MLCC, 1uF, 25V, X5R, +/-10%, 0402, T=0.5mm; Part_Preference: Recommended; Manufacturer: MURATA; Manufacturer_Part_Number: GRM155R61E105KA12; Order_Code_RS: 846-7287; Component_Country_Of_Origin: Japan; ShowFields: YES; ID: 2772; Internal_Part_Number: MCD-00095; Status: Released; Part_Type: Capacitor; Package: 0402; ComponentLink1URL: http://tunmcdsvn.tun.st.com/Component_Documentation_Library/Trunk/Capacitor/MURATA_GRM_Series; Order_Code_Digikey: 490-10017-1-ND; Order_Code_Farnell: 2218855
C40 = MCD-03140: Capacitor, MLCC, 10uF, 6.3V, X5R, +/-20%, 0402, T=0.5mm; Part_Preference: Recommended; Manufacturer: MURATA; Manufacturer_Part_Number: GRM155R60J106ME05D; ShowFields: YES; ID: 5256; Component_Country_Of_Origin: China, Japan; Internal_Part_Number: MCD-03140; Status: Checked; Part_Type: Capacitor; Package: 0402; ComponentLink1URL: http://tunmcdsvn.tun.st.com/Component_Documentation_Library/Trunk/Capacitor/MURATA_GRM_Series; Order_Code_Digikey: 490-GRM155R60J106ME05DTR-ND; Order_Code_Farnell: 3784428; Order_Code_RS: N/A
C42 C147 = MCD-01796: Capacitor, Tantalum, 100uF, 6V3, 40mR, +/-20%,  Type_B (3528 metric), T=1.9mm; Part_Preference: Recommended; Manufacturer: AVX; Manufacturer_Part_Number: TCJB107M006R0040; Component_Country_Of_Origin: Lanskroun; ShowFields: YES; ID: 3896; Revision: July-2002: Re-released for DXP Platform.; Internal_Part_Number: MCD-01796; Status: Released; Part_Type: Capacitor; Package: 3528 (metric); ComponentLink1URL: http://tunmcdsvn.tun.st.com/Component_Documentation_Library/Trunk/Capacitor/AVX_TCJ_Series; Order_Code_Digikey: 478-9994-2-ND; Order_Code_Farnell: 2728622; Order_Code_RS: N/A
C61 C91 C189 C190 C208 C209 C214 C215 C217 = MCD-01356: Capacitor, MLCC, 4.7uF, 6V3, X5R, +/-20%, 0402, T=0.5mm; Manufacturer_Part_Number: GRM155R60J475ME47; Manufacturer: MURATA; Part_Preference: Recommended; Order_Code_RS: 814-5230; Component_Country_Of_Origin: Japan; ShowFields: YES; ID: 3456; Internal_Part_Number: MCD-01356; Status: Released; Part_Type: Capacitor; Package: 0402; ComponentLink1URL: http://tunmcdsvn.tun.st.com/Component_Documentation_Library/Trunk/Capacitor/MURATA_GRM_Series; Order_Code_Digikey: 490-5915-1-ND; Order_Code_Farnell: 2666407
C185-C187 C193 C194 C198 C203 C204 C206 C207 = MCD-03139: Capacitor, MLCC, 22uF, 10V, X5R, +/-20%, 0805, T=1,25mm; Part_Preference: Recommended; Manufacturer: MURATA; Manufacturer_Part_Number: GRM21BR61A226ME51L; ShowFields: YES; ID: 5255; Component_Country_Of_Origin: China, Japan; Internal_Part_Number: MCD-03139; Status: Checked; Part_Type: Capacitor; Package: 0805; ComponentLink1URL: http://tunmcdsvn.tun.st.com/Component_Documentation_Library/Trunk/Capacitor/MURATA_GRM_Series; Order_Code_Digikey: 490-10511-2-ND; Order_Code_Farnell: 2494270; Order_Code_RS: N/A
C219 = MCD-02198: Capacitor, MLCC, 10nF, 50V, X7R, +/-10%, 0402, T=0.5mm; Manufacturer_Part_Number: CC0402KRX7R9BB103; Manufacturer: YAGEO; Part_Preference: Recommended; Order_Code_RS: 6169644; Component_Country_Of_Origin: China; ShowFields: YES; ID: 4298; Internal_Part_Number: MCD-02198; Status: Checked; Part_Type: Capacitor; Package: 0402; ComponentLink1URL: http://tunmcdsvn.tun.st.com/Component_Documentation_Library/Trunk/Capacitor/YAGEO_X7R_Series; Order_Code_Digikey: N/A; Order_Code_Farnell: N/A
L1 L6 = MCD-03143: Inductor, 2.2uH, +/-20%, Itemp= 1700mA, Isat= 2400mA, 0R140, 0806, T=1mm; Part_Preference: Recommended; Manufacturer: MURATA; Manufacturer_Part_Number: DFE201610E-2R2M=P2; ShowFields: YES; ID: 5259; Component_Country_Of_Origin: Vietnam; Internal_Part_Number: MCD-03143; Status: Checked; Part_Type: Inductor; Package: 0806; ComponentLink1URL: http://tunmcdsvn.tun.st.com/Component_Documentation_Library/Trunk/Inductor/MURATA_DFE201610E_Series; Order_Code_Digikey: 490-17728-2-ND -; Order_Code_Farnell: N/A; Order_Code_RS: N/A
L2 L4 = MCD-03142: Inductor, 0.68uH, +/-20%, Itemp= 3900mA, Isat= 5400mA, 0R031, 1008, T=1.2mm; Part_Preference: Recommended; Manufacturer: MURATA; Manufacturer_Part_Number: DFE252012F-R68M=P2; ShowFields: YES; ID: 5258; Component_Country_Of_Origin: Vietnam; Internal_Part_Number: MCD-03142; Status: Checked; Part_Type: Inductor; Package: 1008; ComponentLink1URL: http://tunmcdsvn.tun.st.com/Component_Documentation_Library/Trunk/Inductor/MURATA_DFE252012F-6R8M=P2; Order_Code_Digikey: 490-13044-2-ND; Order_Code_Farnell: N/A; Order_Code_RS: N/A
L3 L5 L7 = MCD-03141: Inductor, 0.68uH, +/-20%, Itemp= 3100mA, Isat= 4300mA, 0R043, 0806, T=1mm; Part_Preference: Recommended; Manufacturer: MURATA; Manufacturer_Part_Number: DFE201610E-R68M=P2; ShowFields: YES; ID: 5257; Component_Country_Of_Origin: Vietnam; Internal_Part_Number: MCD-03141; Status: Checked; Part_Type: Inductor; Package: 0806; ComponentLink1URL: http://tunmcdsvn.tun.st.com/Component_Documentation_Library/Trunk/Inductor/MURATA_DFE201610E_Series; Order_Code_Digikey: N/A; Order_Code_Farnell: N/A; Order_Code_RS: N/A
LD11 = MCD-00588: LED Green, 0603 SMD, Forward Voltage Typ=2V, Max=2.5V; Part_Type: Display; Manufacturer_Part_Number: LG Q396-PS-35; Manufacturer: OSRAM OPTO SEMICONDUCTORS; Alternate_Manufacturer_Part_Number: VLMTG1300-GS08; Alternate_Manufacturer: VISHAY SEMICONDUCTOR OPTO DIVISION; Alternate_Internal_Part_Number: MCD-02400; Part_Preference: Recommended; Provided_By: SUBCO; Component_Country_Of_Origin: Unknown; ID: 3155; ShowFields: YES; Internal_Part_Number: MCD-00588; Status: Released; Package: LED 0603; ComponentLink1Description: Datasheet; ComponentLink1URL: http://tunmcdsvn.tun.st.com/Component_Documentation_Library/Trunk/Display/OSRAM_OPTO_SEMICONDUCTORS_LG-Q396-PS-35; Order_Code_Digikey: LG Q396-PS-35-ND; ECCN_US: n/a; ECCN_EU: n/a; Order_Code_Farnell: N/A; Order_Code_RS: N/A; Full_Alternate_Internal_Part_Number: MCD-02400
LNK1 LNK2 LNK4 LNK7 LNK8 LNK11 = MCD-02777: Track link on PCB 200um width for layout routing; Part_Preference: Recommended; Part_Type: Misc; ID: 4889; ShowFields: YES; Value: link_200; ComponentLink1URL: http://tunmcdsvn.tun.st.com/Component_Documentation_Library/Trunk; Internal_Part_Number: MCD-02777; Manufacturer: N/A; Manufacturer_Part_Number: link_200; Order_Code_Digikey: N/A; Order_Code_Farnell: N/A; Order_Code_RS: N/A; Status: Checked
R46 R57 R59-R61 R81 = MCD-00052: Resistor,0R,0402,5%,1/16W; Manufacturer_Part_Number: RC0402JR-070RL; Manufacturer: YAGEO; Part_Preference: Recommended; ECCN_US: EAR99; ECCN_EU: NEC; Provided_By: SUBCO; Initial_Board_Reference: mb1274; Order_Code_RS: 618-5804; Component_Country_Of_Origin: China; ID: 2540; ShowFields: YES; Internal_Part_Number: MCD-00052; ComponentLink1Description: Datasheet; Status: Released; Part_Type: Resistor; ComponentLink1URL: http://tunmcdsvn.tun.st.com/Component_Documentation_Library/Trunk/Resistor/YAGEO_RC_L_Series; Package: 0402; Alternate_Manufacturer: N/A; Alternate_Manufacturer_Part_Number: N/A; Order_Code_Digikey: 311-0.0JRCT-ND; Order_Code_Farnell: 9232516RL
R210 = MCD-00441: Resistor,270R,0402,1%,1/16W; Manufacturer_Part_Number: RC0402FR-07270RL; Manufacturer: YAGEO; Part_Preference: Recommended; Provided_By: SUBCO; ECCN_US: EAR99; ECCN_EU: NEC; Component_Country_Of_Origin: China; ID: 2838; ShowFields: YES; Internal_Part_Number: MCD-00441; Status: Released; Part_Type: Resistor; Package: 0402; ComponentLink1Description: Datasheet; ComponentLink1URL: http://tunmcdsvn.tun.st.com/Component_Documentation_Library/Trunk/Resistor/YAGEO_RC_L_Series; Order_Code_Digikey: 311-270LRCT-ND; Order_Code_Farnell: 9239162; Order_Code_RS: N/A
TP8 = MCD-00713: Vero Technologies 1.02mm Black Terminal Post; Part_Type: Misc; Manufacturer_Part_Number: 20-2137; Part_Preference: Recommended; Order_Code_RS: 101-2391; Component_Country_Of_Origin: United Kingdom; ID: 3032; ShowFields: YES; Internal_Part_Number: MCD-00713; Status: Released; Manufacturer: VERO; ComponentLink1URL: http://tunmcdsvn.tun.st.com/Component_Documentation_Library/Trunk/Misc/VERO_20-2137; Order_Code_Digikey: N/A; Order_Code_Farnell: N/A
U26 = MCD-03000: STPMIC2; Part_Type: IC; Part_Preference: Recommended; Manufacturer: STMICROELECTRONICS; Component_Country_Of_Origin: Unknown; ShowFields: YES; ID: 5116; ComponentLink1Description: Datasheet; ComponentLink1URL: http://tunmcdsvn.tun.st.com/Component_Documentation_Library/Trunk/IC/STMICROELECTRONICS_STPMIC2; Internal_Part_Number: MCD-03000; Value: STPMIC25APQR; Status: Released; Manufacturer_Part_Number: STPMIC25APQR; Package: VQFN; Order_Code_Digikey: N/A; Order_Code_Farnell: N/A; Order_Code_RS: N/A